# EAGLE design LowVoltageShutdownV2 (EAGLE 9.0.1)
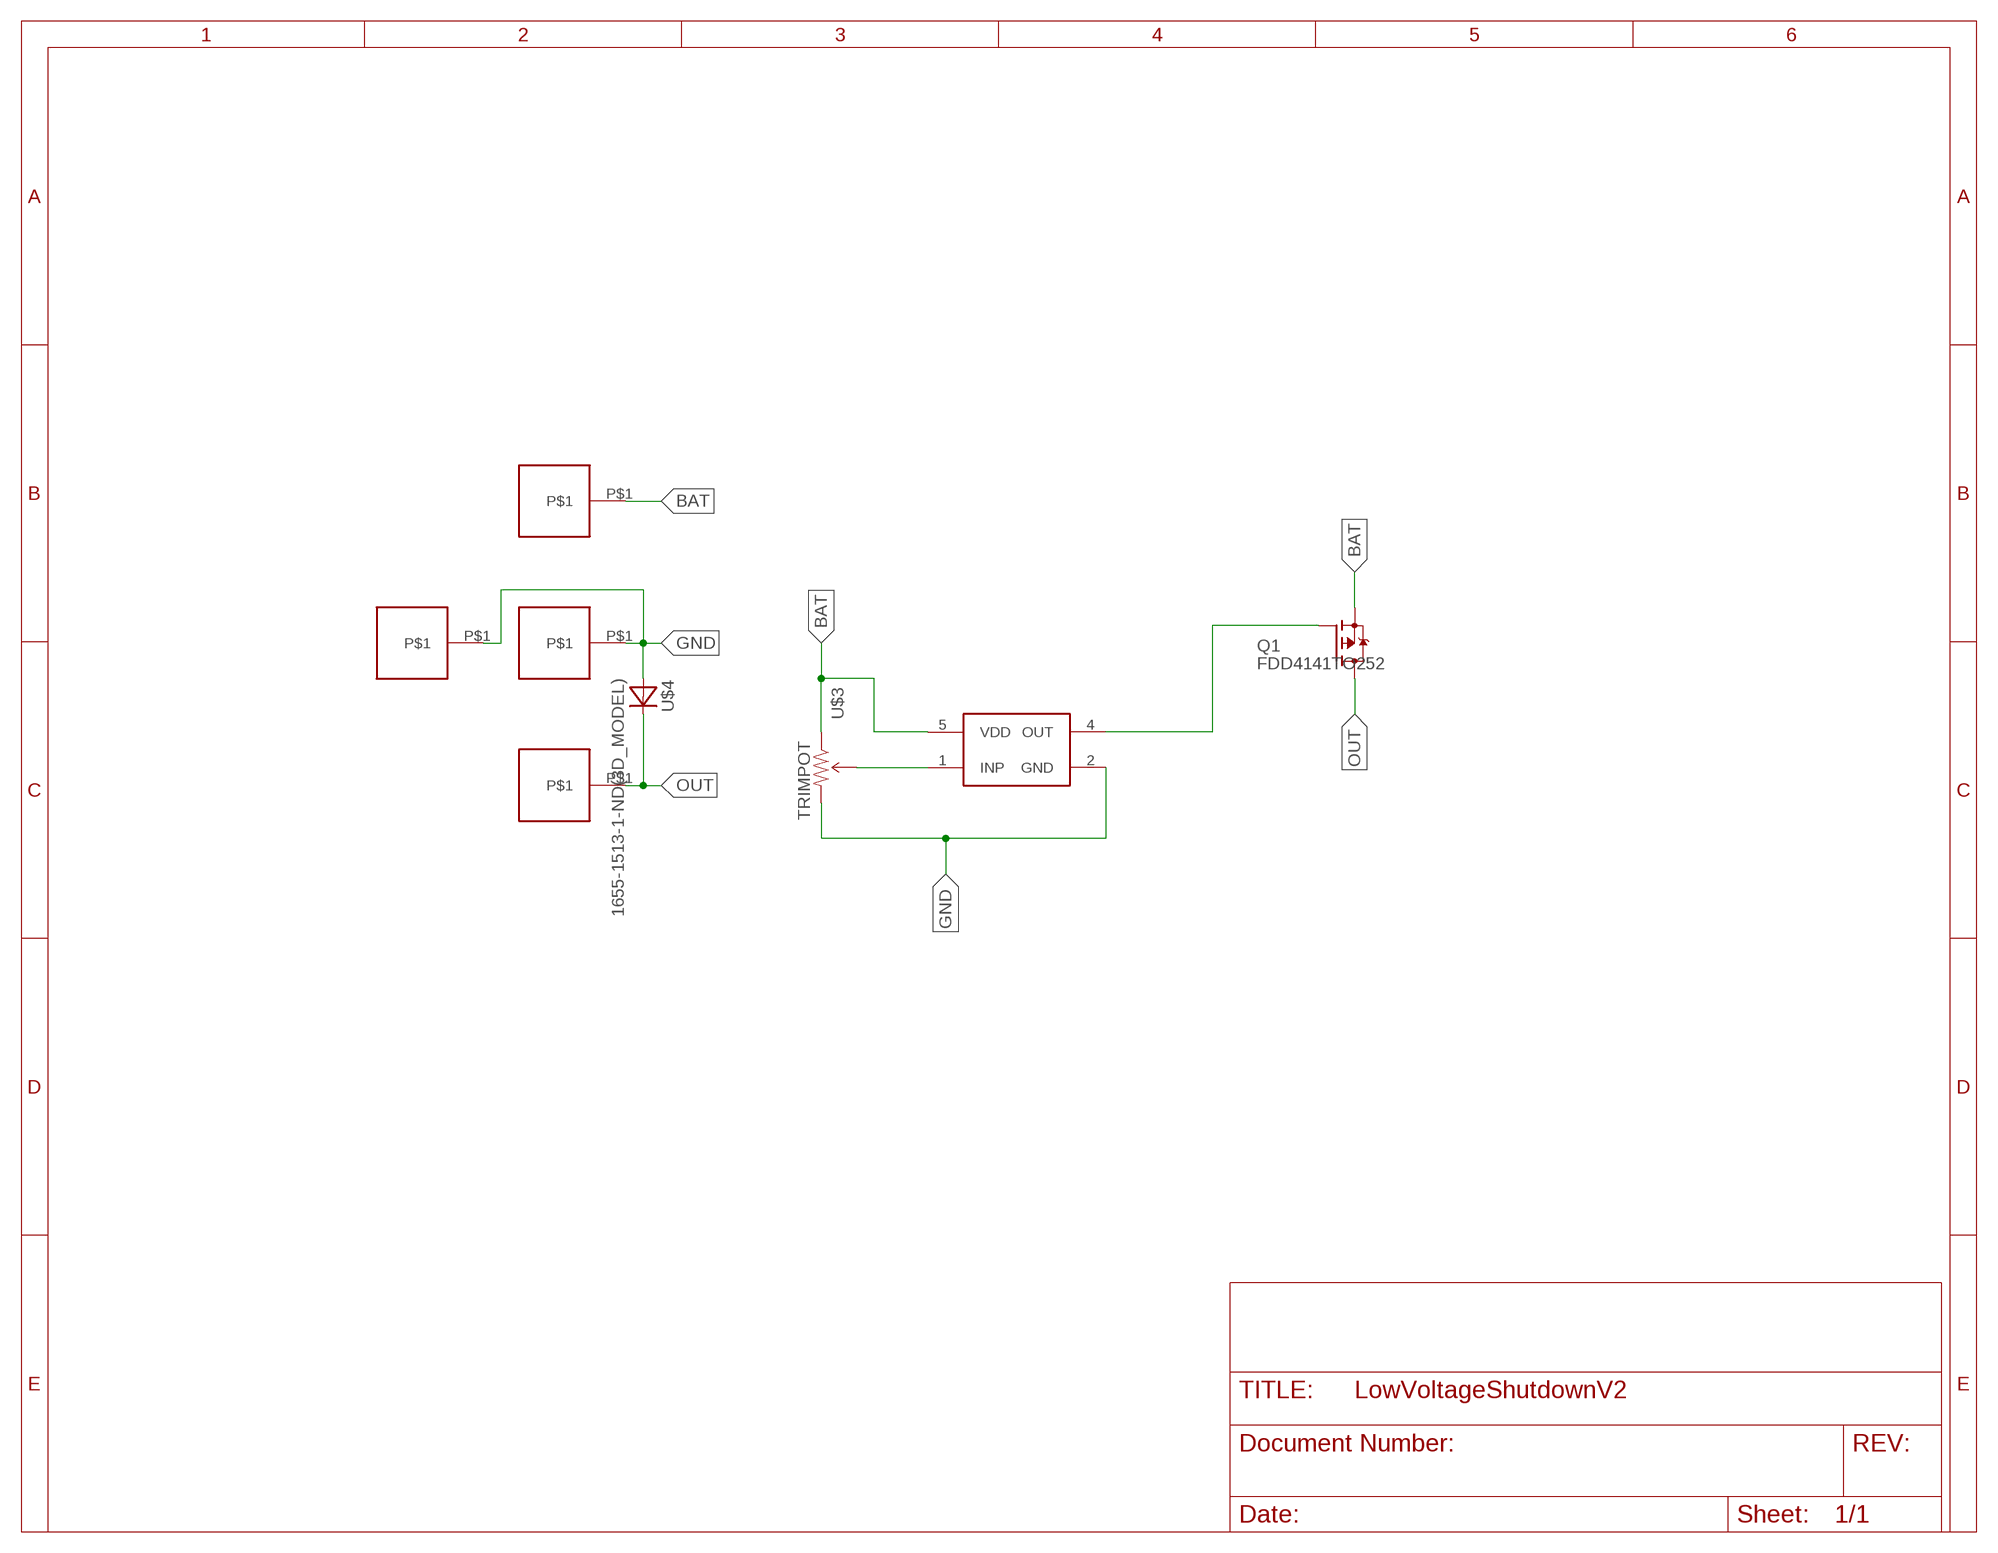
[diagram p0: schematic, sheet 1]

## Parts
OUT  16G  [16G]
OUT1  16G  [16G]
Q1  FDD4141TO252  [TO252]
U$1  MIC842L(3D_MODEL)  [SOTFL65P210X110-5]
U$3  TRIMPOT  [490-2877-ND]
U$4  1655-1513-1-ND(3D_MODEL)  [DIOAD1950W130L900D530B]
U$5  450PAD  [450PAD]
U$6  450PAD  [450PAD]

## Nets
BAT: Q1.2(S) U$1.5(VDD) U$3.P$1(CCW) U$5.P$1
GND: OUT1.P$1 U$1.2(GND) U$3.P$3(CW) U$4.2(A) U$6.P$1
N$1: U$1.1(INP) U$3.P$2(WIPER)
N$5: Q1.1(G) U$1.4(OUT)
OUT: OUT.P$1 Q1.3(D) U$4.1(C)

## Library data of the parts
OUT OUT1 = Wire2Board:16G
Q1 = transistor-fet:FDD4141: P-Channel PowerTrench® MOSFET Source: FDD4141.pdf
U$1 = MIC842L:MIC842L(3D_MODEL)
U$3 = trimpot:TRIMPOT
U$4 = 1655-1513-1-ND:1655-1513-1-ND(3D_MODEL)
U$5 U$6 = Wire2Board:450PAD

## Board
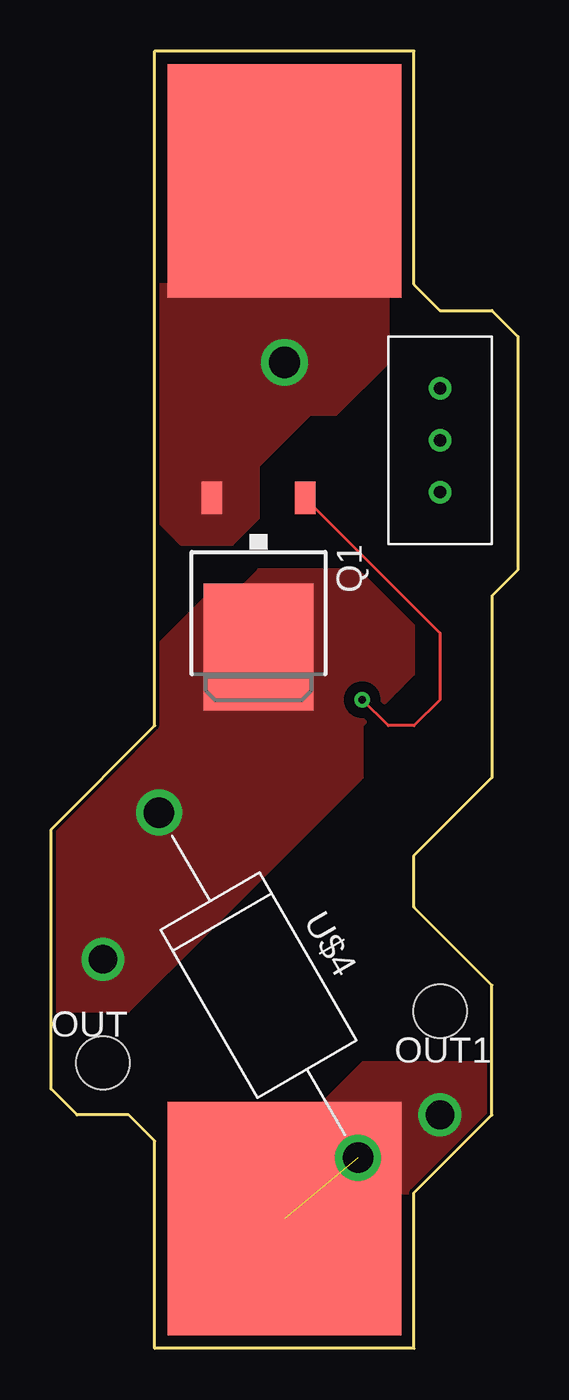
[diagram p1: board, top side]
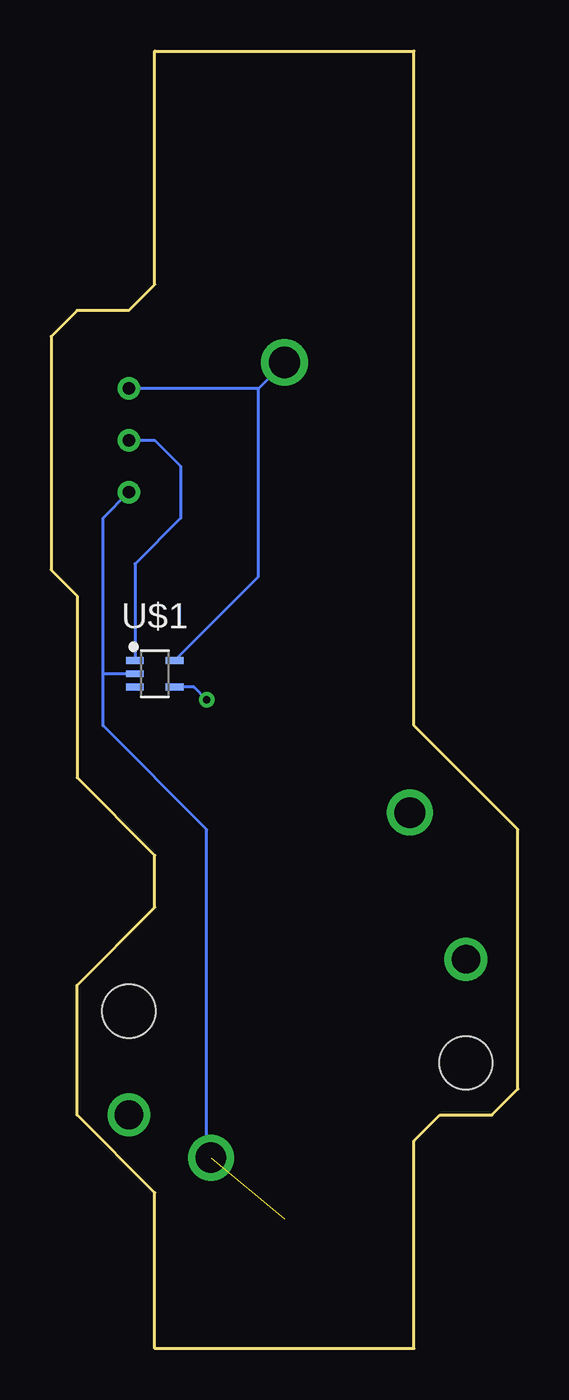
[diagram p2: board, bottom side, seen from below]

Size 22.86 x 63.5 mm. Coordinates in mm from the lower left corner, seen from the top.
Outline: 17.78,0 17.78,7.62 21.59,11.43 21.59,17.78 17.78,21.59 17.78,24.13 21.59,27.94 21.59,36.83 22.86,38.1 22.86,49.53 21.59,50.8 19.05,50.8 17.78,52.07 17.78,63.5 5.08,63.5 5.08,30.48 0,25.4 0,12.7 1.27,11.43 3.81,11.43 5.08,10.16 5.08,0 17.78,0
Copper layers (1*16): Top 0.035mm / dielectric 1.5mm / Bottom 0.035mm
Design rules "default *": minimum track width 6mil, minimum drill 0.35mm, track to track 6mil, track to pad 6mil, pad to pad 6mil, via to via 6mil, smd to smd 6mil, copper to edge 6mil, drill to drill 6mil, minimum pad ring 10mil, minimum via ring 8mil, stop-mask expansion 4mil, vias tented up to drill 0mil, thermal gap 10mil

### Footprints (pad centres in the part's own frame; a part is rotated, then mirrored left to right if it is on the bottom)
16G = drill 1.4: P$1 0,0 | hole 2.6: 5.08,0
TO252 = smd 1 x 1.6: 1 -2.28,-4.8; 2 2.28,-4.8 | smd 5.4 x 6.2: 3 0,2.5
SOTFL65P210X110-5 = smd 0.869 x 0.337: 1 -0.971,0.65; 2 -0.971,0; 3 -0.971,-0.65; 4 0.971,-0.65; 5 0.971,0.65
490-2877-ND = drill 0.6: P$1 0,-2.54; P$2 0,0; P$3 0,2.54
DIOAD1950W130L900D530B = drill 1.5 pad 2.1: 1 -9.75,0; 2 9.75,0
450PAD = smd 11.43 x 11.43: P$1 0,0

### Placement (x,y rotation side)
OUT  2.54,19.05 270 top
OUT1  19.05,11.43 90 top
Q1  10.16,36.83 180 top
U$1  17.78,33.02 0 bottom
U$3  19.05,44.45 180 top
U$4  10.16,17.78 300 top
U$5  11.43,57.15 0 top
U$6  11.43,6.35 0 top

### Tracks (layer width: path | path; a pad name or v marks a point on that pad's centre or on a via)
BAT  (via drill 1.52)
  Bottom 0.152: v11.43,48.26 12.7,46.99 | 12.7,46.99 U$3.P$1 | U$1.5 12.7,37.78 12.7,46.99
  pour Top (no thermals): 5.08,52.07 5.08,45.72 13.97,45.72 16.51,48.26 16.51,52.07
  pour Top (no thermals): 8.89,45.72 16.51,48.26 13.97,45.72
  pour Top (no thermals): 5.08,45.72 5.08,40.64 6.35,39.37 8.89,39.37 10.16,40.64 10.16,43.18 12.7,45.72
GND  (1 unrouted)
  Bottom 0.152: U$3.P$3 20.32,40.64 20.32,33.02 | U$1.2 20.32,33.02 | U$4.2 15.24,9.54 15.24,25.4 20.32,30.48 20.32,33.02
  pour Top (no thermals): 16.51,7.62 17.78,7.62 21.59,11.43 21.59,13.97 15.24,13.97 12.7,11.43 12.7,8.89 13.97,7.62
N$1
  Bottom 0.152: U$3.P$2 17.78,44.45 16.51,43.18 16.51,40.64 18.75,38.4 U$1.1
N$5  (via drill 0.35)
  Top 0.152: v15.24,31.75 16.51,30.48 17.78,30.48 19.05,31.75 19.05,35.02 Q1.1
  Bottom 0.152: v15.24,31.75 15.86,32.37 U$1.4
OUT
  pour Top (no thermals): 0,25.4 0,16.51 3.81,16.51 7.62,20.32 7.62,27.94 6.35,29.21 3.81,29.21
  pour Top (no thermals): 7.62,24.13 6.35,29.21 7.62,27.94
  pour Top (no thermals): 7.62,20.32 11.43,24.13 11.43,36.83 7.62,36.83 5.08,34.29 5.08,30.48 3.81,29.21 6.35,29.21 7.62,27.94
  pour Top (isolate 0.508, no thermals): 11.43,24.13 15.24,27.94 15.24,30.48 17.78,33.02 17.78,35.56 15.24,38.1 12.7,38.1 10.16,38.1 8.89,36.83 8.89,26.67